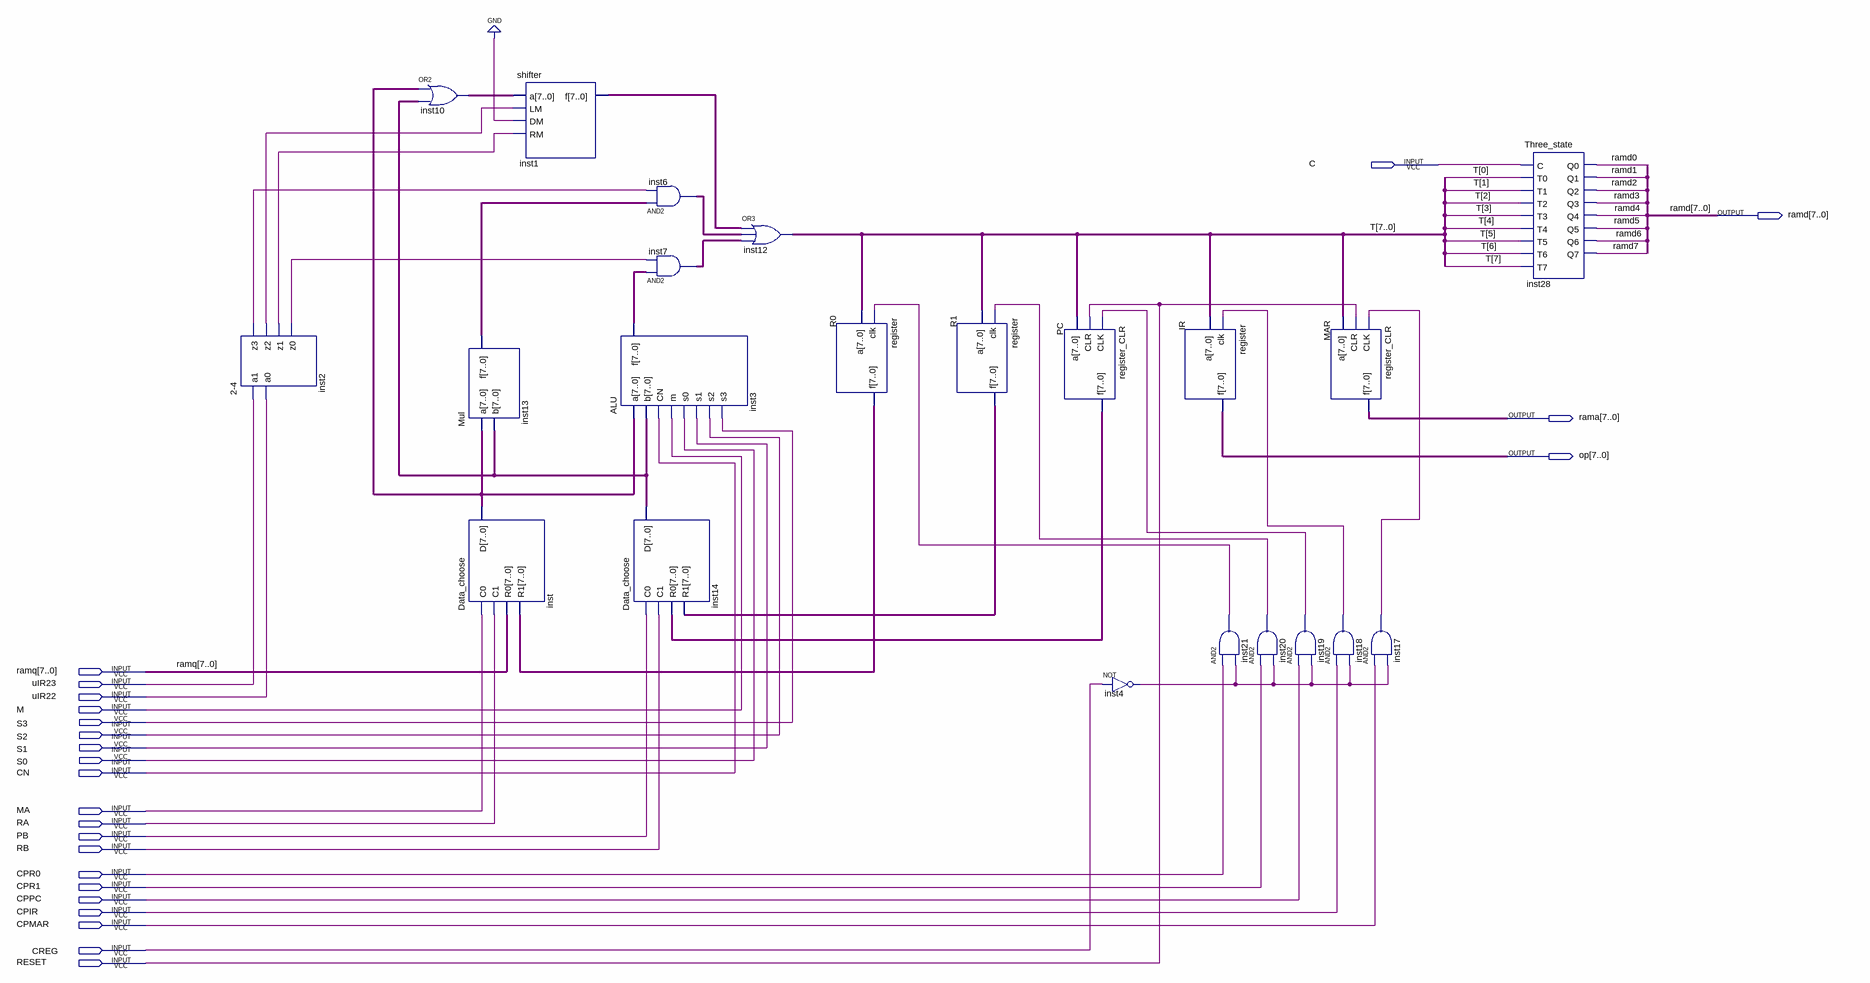
[diagram p0: schematic sheet]
// Quartus schematic ex4.bdf as structural Verilog: 22 symbols, 24 pins
module ex4 (
  input  C,
  input  [7:0] ramq,
  input  uIR23,
  input  uIR22,
  input  M,
  input  S3,
  input  S2,
  input  S1,
  input  S0,
  input  CN,
  input  MA,
  input  RA,
  input  PB,
  input  RB,
  input  CPR0,
  input  CPR1,
  input  CPPC,
  input  CPIR,
  input  CPMAR,
  input  CREG,
  input  RESET,
  output [7:0] ramd,
  output [7:0] rama,
  output [7:0] op
);

  wire inst2_z0, inst2_z1, inst2_z2, inst2_z3, inst4_out, inst17_out, inst18_out, inst19_out, inst20_out,
       inst21_out;
  wire [7:0] inst1_f, inst3_f, inst6_out, inst7_out, inst10_out, inst13_f, inst14_d, inst_d, PC_f, R0_f,
       R1_f, T;

  \2-4  inst2 (.a1(uIR23), .a0(uIR22), .z3(inst2_z3), .z2(inst2_z2), .z1(inst2_z1), .z0(inst2_z0));
  assign inst10_out = inst_d | inst14_d;  // OR2 inst10, 8 bits wide
  Mul inst13 (.a(inst_d), .b(inst14_d), .f(inst13_f));
  Data_choose inst (.C0(MA), .C1(RA), .R0(ramq), .R1(R0_f), .D(inst_d));
  shifter inst1 (.a(inst10_out), .LM(inst2_z2), .DM(1'b0), .RM(inst2_z1), .f(inst1_f));
  ALU inst3 (.a(inst_d), .b(inst14_d), .CN(CN), .m(M), .s0(S0), .s1(S1), .s2(S2), .s3(S3), .f(inst3_f));
  Data_choose inst14 (.C0(PB), .C1(RB), .R0(PC_f), .R1(R1_f), .D(inst14_d));
  assign inst6_out = inst13_f & {8{inst2_z3}};  // AND2 inst6, 8 bits wide
  assign inst7_out = inst3_f & {8{inst2_z0}};  // AND2 inst7, 8 bits wide
  assign T = inst1_f | inst6_out | inst7_out;  // OR3 inst12, 8 bits wide
  register R0 (.clk(inst21_out), .a(T), .f(R0_f));
  register R1 (.clk(inst20_out), .a(T), .f(R1_f));
  register_CLR PC (.CLK(inst19_out), .CLR(RESET), .a(T), .f(PC_f));
  not inst4 (inst4_out, CREG);
  register IR (.clk(inst18_out), .a(T), .f(op));
  and inst21 (inst21_out, CPR0, inst4_out);
  and inst19 (inst19_out, CPPC, inst4_out);
  and inst20 (inst20_out, CPR1, inst4_out);
  register_CLR MAR (.CLK(inst17_out), .CLR(RESET), .a(T), .f(rama));
  and inst18 (inst18_out, CPIR, inst4_out);
  and inst17 (inst17_out, CPMAR, inst4_out);
  Three_state inst28 (
    .C(C), .T0(T[0]), .T1(T[1]), .T2(T[2]), .T3(T[3]), .T4(T[4]), .T5(T[5]), .T6(T[6]), .T7(T[7]),
    .Q0(ramd[0]), .Q1(ramd[1]), .Q2(ramd[2]), .Q3(ramd[3]), .Q4(ramd[4]), .Q5(ramd[5]), .Q6(ramd[6]),
    .Q7(ramd[7]));
endmodule
